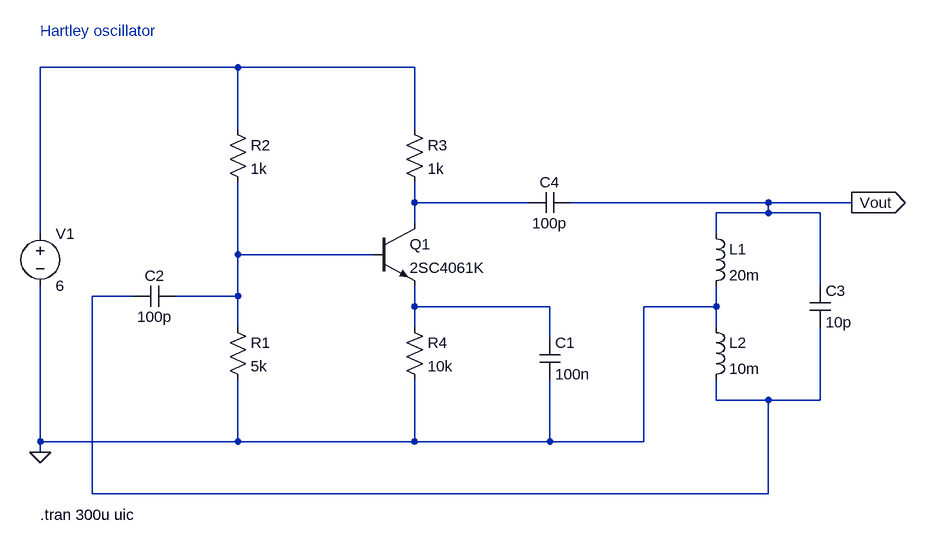
[diagram p0: schematic HARTLEY.asc]
HARTLEY.asc, the LTspice schematic file:
Version 4.1
SHEET 1 1296 680
WIRE 240 -128 -64 -128
WIRE 512 -128 240 -128
WIRE 240 -32 240 -128
WIRE 512 -32 512 -128
WIRE 512 80 512 48
WIRE 688 80 512 80
WIRE 1056 80 752 80
WIRE 1184 80 1056 80
WIRE 1056 96 1056 80
WIRE 1056 96 976 96
WIRE 1136 96 1056 96
WIRE 512 112 512 80
WIRE -64 128 -64 -128
WIRE 976 128 976 96
WIRE 240 160 240 48
WIRE 448 160 240 160
WIRE 1136 208 1136 96
WIRE 80 224 16 224
WIRE 240 224 240 160
WIRE 240 224 144 224
WIRE 512 240 512 208
WIRE 720 240 512 240
WIRE 976 240 976 208
WIRE 976 240 864 240
WIRE 240 272 240 224
WIRE 512 272 512 240
WIRE 976 272 976 240
WIRE 720 288 720 240
WIRE 976 384 976 352
WIRE 1056 384 976 384
WIRE 1136 384 1136 272
WIRE 1136 384 1056 384
WIRE -64 448 -64 208
WIRE 240 448 240 352
WIRE 240 448 -64 448
WIRE 512 448 512 352
WIRE 512 448 240 448
WIRE 720 448 720 352
WIRE 720 448 512 448
WIRE 864 448 864 240
WIRE 864 448 720 448
WIRE -64 464 -64 448
WIRE 16 528 16 224
WIRE 1056 528 1056 384
WIRE 1056 528 16 528
FLAG 1184 80 Vout
IOPIN 1184 80 Out
FLAG -64 464 0
SYMBOL voltage -64 112 R0
WINDOW 123 0 0 Left 0
WINDOW 39 0 0 Left 0
SYMATTR InstName V1
SYMATTR Value 6
SYMBOL npn 448 112 R0
SYMATTR InstName Q1
SYMATTR Value 2SC4061K
SYMBOL res 224 256 R0
SYMATTR InstName R1
SYMATTR Value 5k
SYMBOL res 224 -48 R0
SYMATTR InstName R2
SYMATTR Value 1k
SYMBOL res 496 -48 R0
SYMATTR InstName R3
SYMATTR Value 1k
SYMBOL res 496 256 R0
SYMATTR InstName R4
SYMATTR Value 10k
SYMBOL cap 704 288 R0
SYMATTR InstName C1
SYMATTR Value 100n
SYMBOL cap 144 208 R90
WINDOW 0 0 32 VBottom 2
WINDOW 3 32 32 VTop 2
SYMATTR InstName C2
SYMATTR Value 100p
SYMBOL cap 1120 208 R0
SYMATTR InstName C3
SYMATTR Value 10p
SYMBOL cap 752 64 R90
WINDOW 0 0 32 VBottom 2
WINDOW 3 32 32 VTop 2
SYMATTR InstName C4
SYMATTR Value 100p
SYMBOL ind 960 112 R0
SYMATTR InstName L1
SYMATTR Value 20m
SYMBOL ind 960 256 R0
SYMATTR InstName L2
SYMATTR Value 10m
TEXT -64 -184 Left 2 ;Hartley oscillator
TEXT -64 560 Left 2 !.tran 300u uic

The netlist it stands for:
* HARTLEY.asc
V1 N001 0 6
Q1 N002 N003 N005 0 2SC4061K
R1 N003 0 5k
R2 N001 N003 1k
R3 N001 N002 1k
R4 N005 0 10k
C1 N005 0 100n
C2 N003 N004 100p
C3 Vout N004 10p
C4 Vout N002 100p
L1 Vout 0 20m
L2 0 N004 10m
.model NPN NPN
.model PNP PNP
.lib standard.bjt
* Hartley oscillator
.tran 300u uic
.backanno
.end